# Altium schematic sheet SiLPA.schdoc: SiLPA
size 420 x 297 mm; EDA_Number: ARTIQ; Projet: ARTIQ/SINARA; Author: G.Kasprowicz; CompanyName: WUT ISE; DrawnBy: G.Kasprowicz; Organization: WUT ISE; Address1: PW ISE; Address2: Nowowiejska 15/19 00-665 Warsaw; Address3: gkasprow@gmail.com; DocumentNumber: 1; Revision: 2; SheetNumber: 1; SheetTotal: 7; ModifiedBy: -; CheckedDate: -; Title2: Top; DivGrp: WUT ISE; Designer: G.Kasprowicz; ModifiedDate: -; ProjectName: Sensor Box
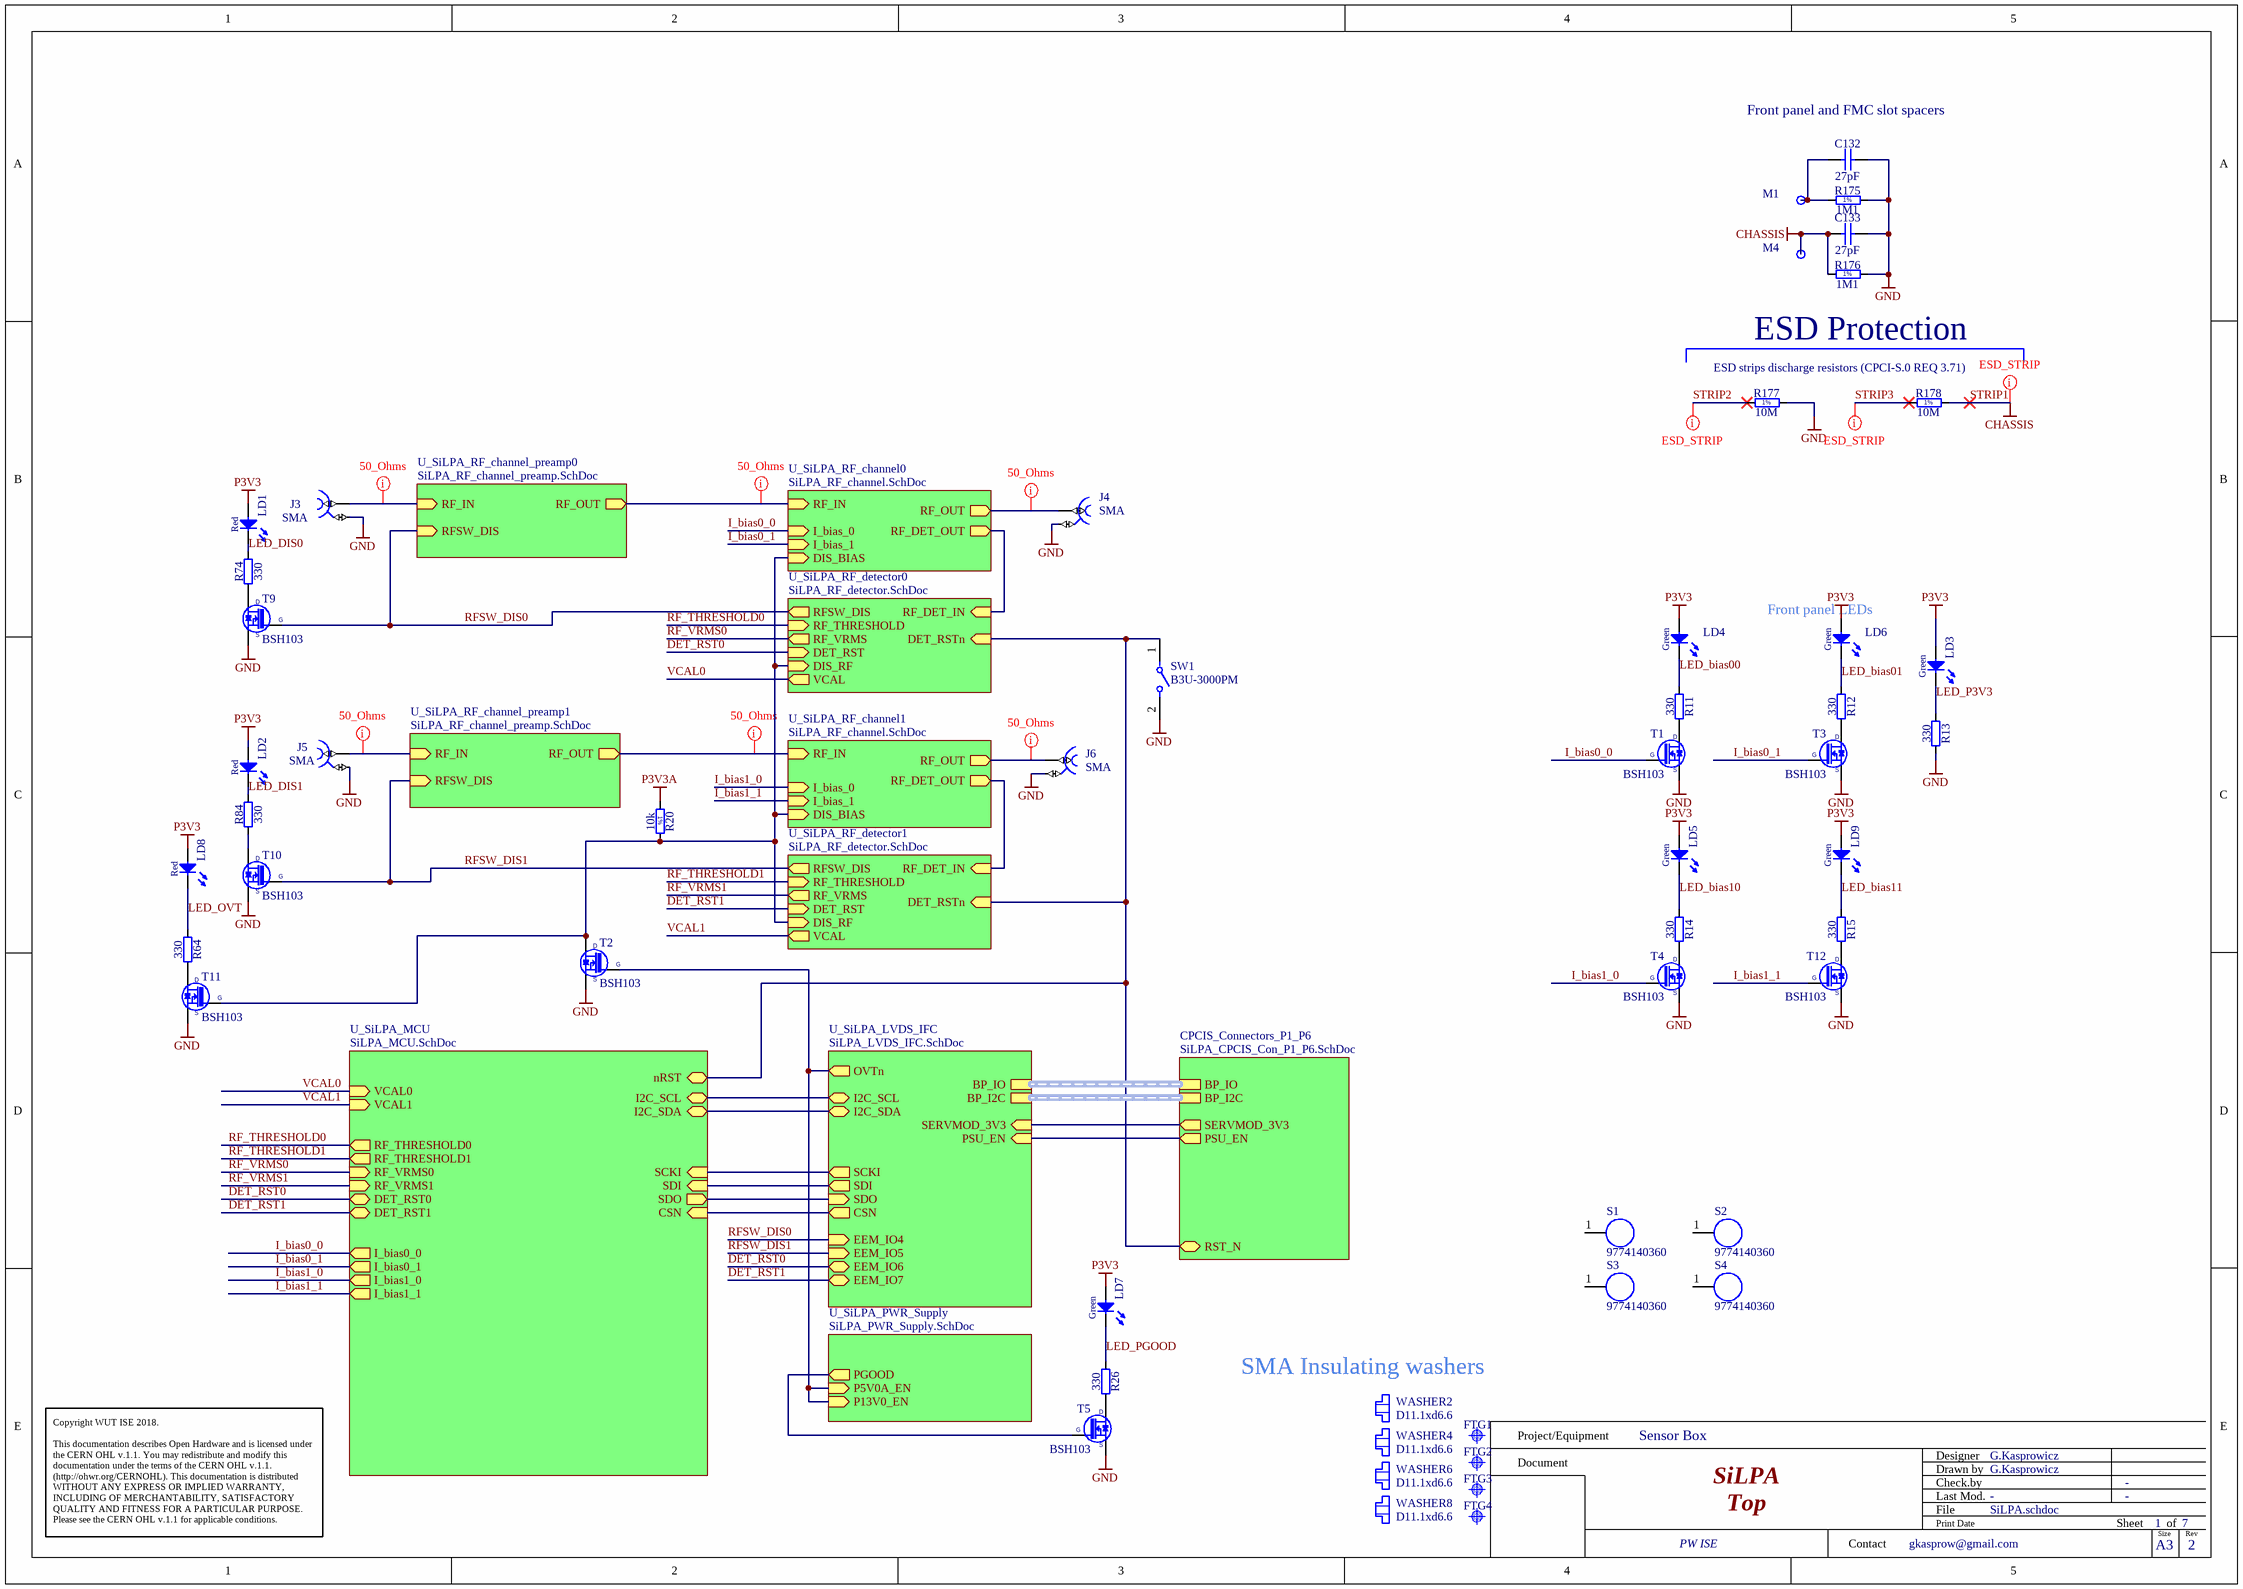
[diagram p0: SiLPA.schdoc]

## Parts
C132  27pF  [CAPC1005X55N]
C133  27pF  [CAPC1005X55N]
FTG1  Use only in PCB  [FIDUCIAL_TOP_C100-200]  (value not drawn)
FTG2  Use only in PCB  [FIDUCIAL_TOP_S100-200]  (value not drawn)
FTG3  Use only in PCB  [FIDUCIAL_TOP_S100-200]  (value not drawn)
FTG4  Use only in PCB  [FIDUCIAL_TOP_S100-200]  (value not drawn)
J3  SMA  [DELOCK_65848]
J4  SMA  [DELOCK_65848]
J5  SMA  [DELOCK_65848]
J6  SMA  [DELOCK_65848]
LD1  Red  [LED_AVAGO_HSMC-C120]
LD2  Red  [LED_AVAGO_HSMC-C120]
LD3  Green  [LED_AVAGO_HSME-C120]
LD4  Green  [LED_AVAGO_HSME-C120]
LD5  Green  [LED_AVAGO_HSME-C120]
LD6  Green  [LED_AVAGO_HSME-C120]
LD7  Green  [LED_AVAGO_HSME-C120]
LD8  Red  [LED_AVAGO_HSMC-C120]
LD9  Green  [LED_AVAGO_HSME-C120]
M1  Plated Hole  [MTG300_600]  (value not drawn)  (no BOM)
M4  Plated Hole  [MTG300_600]  (value not drawn)  (no BOM)
R11  330  [RESC1005X40N]
R12  330  [RESC1005X40N]
R13  330  [RESC1005X40N]
R14  330  [RESC1005X40N]
R15  330  [RESC1005X40N]
R20  10k  [RESC1005X40N]
R26  330  [RESC1005X40N]
R64  330  [RESC1005X40N]
R74  330  [RESC1005X40N]
R84  330  [RESC1005X40N]
R175  1M1  [RESC2012X60N]
R176  1M1  [RESC2012X60N]
R177  10M  [RESC2113X55N]
R178  10M  [RESC2113X55N]
S1  9774140360  [9774140360]
S2  9774140360  [9774140360]
S3  9774140360  [9774140360]
S4  9774140360  [9774140360]
SW1  B3U-3000PM  [FP-B3U-3000PM-MFG]
T1  BSH103  [SOT95P230X110-3N]
T2  BSH103  [SOT95P230X110-3N]
T3  BSH103  [SOT95P230X110-3N]
T4  BSH103  [SOT95P230X110-3N]
T5  BSH103  [SOT95P230X110-3N]
T9  BSH103  [SOT95P230X110-3N]
T10  BSH103  [SOT95P230X110-3N]
T11  BSH103  [SOT95P230X110-3N]
T12  BSH103  [SOT95P230X110-3N]
WASHER2  D11.1xd6.6  [Keystone_7687]
WASHER4  D11.1xd6.6  [Keystone_7687]
WASHER6  D11.1xd6.6  [Keystone_7687]
WASHER8  D11.1xd6.6  [Keystone_7687]

## Sub-sheets
CPCIS_Connectors_P1_P6 = SiLPA_CPCIS_Con_P1_P6.SchDoc: BP_I2C (harness I2C), SERVMOD_3V3 (out), RST_N (bidir), BP_IO (harness EEM_LVDS), PSU_EN (out)
U_SiLPA_LVDS_IFC = SiLPA_LVDS_IFC.SchDoc: I2C_SCL (bidir), EEM_IO6 (bidir), SCKI (out), SDI (out), SDO (in), EEM_IO5 (in), I2C_SDA (bidir), CSN (out), EEM_IO4 (in), EEM_IO7 (bidir), OVTn (out), BP_IO (harness EEM_LVDS), BP_I2C (harness I2C), SERVMOD_3V3 (in), PSU_EN (in)
U_SiLPA_MCU = SiLPA_MCU.SchDoc: RF_THRESHOLD0 (out), RF_THRESHOLD1 (out), RF_VRMS0 (in), RF_VRMS1 (in), DET_RST0 (bidir), DET_RST1 (bidir), CSN (in), SDO (out), SDI (in), SCKI (in), I2C_SCL (bidir), I2C_SDA (bidir), VCAL1 (in), VCAL0 (in), I_bias0_0 (out), I_bias0_1 (out), I_bias1_0 (out), I_bias1_1 (out), nRST (bidir)
U_SiLPA_PWR_Supply = SiLPA_PWR_Supply.SchDoc: PGOOD (out), P5V0A_EN (in), P13V0_EN (in)
U_SiLPA_RF_channel0 = SiLPA_RF_channel.SchDoc: RF_OUT (out), RF_IN (in), RF_DET_OUT (out), I_bias_1 (in), I_bias_0 (in), DIS_BIAS (in)
U_SiLPA_RF_channel1 = SiLPA_RF_channel.SchDoc: RF_OUT (out), RF_IN (in), RF_DET_OUT (out), I_bias_1 (in), I_bias_0 (in), DIS_BIAS (in)
U_SiLPA_RF_channel_preamp0 = SiLPA_RF_channel_preamp.SchDoc: RF_IN (in), RF_OUT (out), RFSW_DIS (in)
U_SiLPA_RF_channel_preamp1 = SiLPA_RF_channel_preamp.SchDoc: RF_IN (in), RF_OUT (out), RFSW_DIS (in)
U_SiLPA_RF_detector0 = SiLPA_RF_detector.SchDoc: RF_DET_IN (in), RFSW_DIS (out), RF_THRESHOLD (in), RF_VRMS (out), DET_RST (in), VCAL (out), DIS_RF (in), DET_RSTn (in)
U_SiLPA_RF_detector1 = SiLPA_RF_detector.SchDoc: RF_DET_IN (in), RFSW_DIS (out), RF_THRESHOLD (in), RF_VRMS (out), DET_RST (in), VCAL (out), DET_RSTn (in), DIS_RF (in)

## Nets
GND: C132.2 C133.2 J3.2 J4.2 J5.2 J6.2 R13.2 R175.2 R176.2 R177.2 SW1.2 T1.2(S) T2.2(S) T3.2(S) T4.2(S) T5.2(S) T9.2(S) T10.2(S) T11.2(S) T12.2(S)
P3V3: LD1.2(A) LD2.2(A) LD3.2(A) LD4.2(A) LD5.2(A) LD6.2(A) LD7.2(A) LD8.2(A) LD9.2(A)
P3V3A: R20.1
STRIP1: C133.1 M4.1 R176.1 R178.2  [also labelled CHASSIS]
DET_RST0: sheet U_SiLPA_LVDS_IFC/EEM_IO6, sheet U_SiLPA_RF_detector0/DET_RST, sheet U_SiLPA_MCU/DET_RST0
DET_RST1: sheet U_SiLPA_LVDS_IFC/EEM_IO7, sheet U_SiLPA_RF_detector1/DET_RST, sheet U_SiLPA_MCU/DET_RST1
I_bias0_0: T1.1(G) ; sheet U_SiLPA_RF_channel0/I_bias_0, sheet U_SiLPA_MCU/I_bias0_0
I_bias0_1: T3.1(G) ; sheet U_SiLPA_RF_channel0/I_bias_1, sheet U_SiLPA_MCU/I_bias0_1
I_bias1_0: T4.1(G) ; sheet U_SiLPA_RF_channel1/I_bias_0, sheet U_SiLPA_MCU/I_bias1_0
I_bias1_1: T12.1(G) ; sheet U_SiLPA_RF_channel1/I_bias_1, sheet U_SiLPA_MCU/I_bias1_1
LED_bias00: LD4.1(C) R11.1
LED_bias01: LD6.1(C) R12.1
LED_bias10: LD5.1(C) R14.1
LED_bias11: LD9.1(C) R15.1
LED_DIS0: LD1.1(C) R74.1
LED_DIS1: LD2.1(C) R84.1
LED_OVT: LD8.1(C) R64.1
LED_P3V3: LD3.1(C) R13.1
LED_PGOOD: LD7.1(C) R26.1
RF_THRESHOLD0: sheet U_SiLPA_RF_detector0/RF_THRESHOLD, sheet U_SiLPA_MCU/RF_THRESHOLD0
RF_THRESHOLD1: sheet U_SiLPA_RF_detector1/RF_THRESHOLD, sheet U_SiLPA_MCU/RF_THRESHOLD1
RF_VRMS0: sheet U_SiLPA_RF_detector0/RF_VRMS, sheet U_SiLPA_MCU/RF_VRMS0
RF_VRMS1: sheet U_SiLPA_RF_detector1/RF_VRMS, sheet U_SiLPA_MCU/RF_VRMS1
RFSW_DIS0: T9.1(G) ; sheet U_SiLPA_LVDS_IFC/EEM_IO4, sheet U_SiLPA_RF_channel_preamp0/RFSW_DIS, sheet U_SiLPA_RF_detector0/RFSW_DIS
RFSW_DIS1: T10.1(G) ; sheet U_SiLPA_LVDS_IFC/EEM_IO5, sheet U_SiLPA_RF_channel_preamp1/RFSW_DIS, sheet U_SiLPA_RF_detector1/RFSW_DIS
STRIP2: R177.1
STRIP3: R178.1
VCAL0: sheet U_SiLPA_RF_detector0/VCAL, sheet U_SiLPA_MCU/VCAL0
VCAL1: sheet U_SiLPA_RF_detector1/VCAL, sheet U_SiLPA_MCU/VCAL1
NetC132_1: C132.1 M1.1 R175.1
NetJ3_1: J3.1 ; sheet U_SiLPA_RF_channel_preamp0/RF_IN
NetJ4_1: J4.1 ; sheet U_SiLPA_RF_channel0/RF_OUT
NetJ5_1: J5.1 ; sheet U_SiLPA_RF_channel_preamp1/RF_IN
NetJ6_1: J6.1 ; sheet U_SiLPA_RF_channel1/RF_OUT
NetR11_2: R11.2 T1.3(D)
NetR12_2: R12.2 T3.3(D)
NetR14_2: R14.2 T4.3(D)
NetR15_2: R15.2 T12.3(D)
NetR20_2: R20.2 T2.3(D) T11.1(G) ; sheet U_SiLPA_RF_channel0/DIS_BIAS, sheet U_SiLPA_RF_detector0/DIS_RF, sheet U_SiLPA_RF_detector1/DIS_RF, sheet U_SiLPA_RF_channel1/DIS_BIAS
NetR26_2: R26.2 T5.3(D)
NetR64_2: R64.2 T11.3(D)
NetR74_2: R74.2 T9.3(D)
NetR84_2: R84.2 T10.3(D)
NetSW1_1: SW1.1 ; sheet U_SiLPA_RF_detector0/DET_RSTn, sheet U_SiLPA_RF_detector1/DET_RSTn, sheet U_SiLPA_MCU/nRST, sheet CPCIS_Connectors_P1_P6/RST_N
NetT2_1: T2.1(G) ; sheet U_SiLPA_LVDS_IFC/OVTn, sheet U_SiLPA_PWR_Supply/P5V0A_EN, sheet U_SiLPA_PWR_Supply/P13V0_EN
NetT5_1: T5.1(G) ; sheet U_SiLPA_PWR_Supply/PGOOD
(unnamed): sheet U_SiLPA_LVDS_IFC/I2C_SCL, sheet U_SiLPA_MCU/I2C_SCL
(unnamed): sheet U_SiLPA_LVDS_IFC/SCKI, sheet U_SiLPA_MCU/SCKI
(unnamed): sheet U_SiLPA_LVDS_IFC/SDI, sheet U_SiLPA_MCU/SDI
(unnamed): sheet U_SiLPA_LVDS_IFC/SDO, sheet U_SiLPA_MCU/SDO
(unnamed): sheet U_SiLPA_LVDS_IFC/I2C_SDA, sheet U_SiLPA_MCU/I2C_SDA
(unnamed): sheet U_SiLPA_LVDS_IFC/CSN, sheet U_SiLPA_MCU/CSN
(unnamed): sheet U_SiLPA_LVDS_IFC/SERVMOD_3V3, sheet CPCIS_Connectors_P1_P6/SERVMOD_3V3
(unnamed): sheet U_SiLPA_LVDS_IFC/PSU_EN, sheet CPCIS_Connectors_P1_P6/PSU_EN
(unnamed): sheet U_SiLPA_RF_channel0/RF_IN, sheet U_SiLPA_RF_channel_preamp0/RF_OUT
(unnamed): sheet U_SiLPA_RF_channel0/RF_DET_OUT, sheet U_SiLPA_RF_detector0/RF_DET_IN
(unnamed): sheet U_SiLPA_RF_channel_preamp1/RF_OUT, sheet U_SiLPA_RF_channel1/RF_IN
(unnamed): sheet U_SiLPA_RF_detector1/RF_DET_IN, sheet U_SiLPA_RF_channel1/RF_DET_OUT

Not connected (* = marked no-connect by the designer): S1 1; S2 1; S3 1; S4 1

## Buses and harness runs
harness sheet CPCIS_Connectors_P1_P6/BP_I2C = sheet U_SiLPA_LVDS_IFC/BP_I2C
harness sheet CPCIS_Connectors_P1_P6/BP_IO = sheet U_SiLPA_LVDS_IFC/BP_IO

## Layout directives
net class 50_Ohms: (no net found under the mark), NetJ3_1, NetJ4_1, NetJ5_1, NetJ6_1
net class ESD_STRIP: STRIP1, STRIP2, STRIP3

## Notes on the sheet
- (near C132) Front panel and FMC slot spacers
- ESD strips discharge resistors (CPCI-S.0 REQ 3.71)
- ESD Protection
- (near LD6) Front panel LEDs
- (near WASHER2) SMA Insulating washers
- Project/Equipment
- Document
- Designer
- Drawn by
- Check.by
- Copyright WUT ISE 2018.
  This documentation describes Open Hardware and is licensed under the CERN OHL v.1.1. You may redistribute and modify this documentation under the terms of the CERN OHL v.1.1. (http://ohwr.org/CERNOHL). This documentation is distributed WITHOUT ANY EXPRESS OR IMPLIED WARRANTY, INCLUDING OF MERCHANTABILITY, SATISFACTORY QUALITY AND FITNESS FOR A PARTICULAR PURPOSE. Please see the CERN OHL v.1.1 for applicable conditions.
- Contact
- File
- Last Mod.
- Print Date
- Sheet
- Size
- A3
- of
- Rev
- (in symbol R0402_10K_1%_0.0625W_100PPM) 1%
- (in symbol R0805_1M1_1%_0.125W_100PPM) 1%
- (in symbol R0805_10M_1%_0.125W_100PPM_VISHAY_CRCW e3) 1%

## Library data of the parts
C132 C133 = CC0402_27PF_50V_5%_C0G: Non-polarised capacitor; Part Description: SMD Multilayer Chip Ceramic Capacitor; Manufacturer: GENERIC; Manufacturer1 Part Number: C0402C270J5GACTU; Voltage: 50V; TC: C0G/NP0; Tolerance: ±5%; Part Number: CC0402_27PF_50V_5%_C0G; Component Kind: Standard; Component Type: Standard; Pin Count: 2; Value: 27pF; Status: Preferred; Manufacturer Part Number: CC0402_27PF_50V_5%_C0G; Case: 0402; Mounted: Yes; Socket: No; SMD: Yes; Manufacturer1 Example: KEMET; Manufacturer1 ComponentHeight: 0.55mm; HelpURL: \\cern.ch\dfs\Applications\Altium\Datasheets\CC0402_C0G_KEMET_(Commercial Grade).pdf; Author: CERN DEM JLC; CreateDate: 25/10/2012; LatestRevisionDate: 22/04/2015; Sense: No
FTG1 = FIDUCIAL_TARGET_C100-200: Fiducial Target; Part Description: Round Fiducial Target, Top Layer, 1.0mm, Top Solder 2.0mm, Keepout =2.0mm; Mounted: No; Part Number: FIDUCIAL_TARGET_C100-200; Component Kind: Standard (No BOM); Component Type: Standard (No BOM); Pin Count: 1; Family: Fiducial; Socket: No; SMD: Yes; Sense: No; Status: None; ComponentHeight: 0mm; HelpURL: Undefined; Author: CERN DEM JLC; CreateDate: 09.02.2010; LatestRevisionDate: 04.04.2012; PackageDescription: Round Fiducial Target, Top Layer, 1.0mm, Top Solder 2.0mm, Keepout =2.0mm
FTG2-FTG4 = FIDUCIAL_TARGET_S100-200: Fiducial Target; Part Description: Square Fiducial Target, Top Layer, 1.0mm, Top Solder 2.0mm, Keepout =2.0mm; Mounted: No; Part Number: FIDUCIAL_TARGET_S100-200; Component Kind: Standard (No BOM); Component Type: Standard (No BOM); Pin Count: 1; Family: Fiducial; Socket: No; SMD: Yes; Sense: No; Status: None; ComponentHeight: 0mm; HelpURL: Undefined; Author: CERN DEM JLC; CreateDate: 09.02.2010; LatestRevisionDate: 04.04.2012; PackageDescription: Square Fiducial Target, Top Layer, 1.0mm, Top Solder 2.0mm, Keepout =2.0mm
J3-J6 = DELOCK_65848: 50 Ohm Through Hole SMA Right Angle PCB Jack; Manufacturer: DELOCK; Manufacturer Part Number: 5848 (4043619658480); PressFit: No; Part Number: DELOCK_65848; Component Kind: Standard; Component Type: Standard; Pin Count: 5; Family: SMA; Mounted: Yes; Socket: No; SMD: No; Sense: No; Status: None; Part Description: 50 Ohm Through Hole SMA Right Angle PCB Jack; ComponentHeight: 12.5; HelpURL: \\cern.ch\dfs\Applications\Altium\Datasheets\AMPHENOL_132203-16.pdf; Author: GK; CreateDate: 13.05.2019; LatestRevisionDate: 13.05.2019
LD1 LD2 LD8 = LED_AVAGO_HSMC-C120: LED Red 1C 2A; Part Description: High Performance Right Angle Chip Red LED; Manufacturer: AVAGO TECHNOLOGIES; PressFit: No; Bonding: No; Part Number: LED_AVAGO_HSMC-C120; Component Kind: Standard; Component Type: Standard; Color: Red; PackageDescription: Red Chip LED, 2-Leads, Body 1.7x1.1mm, Side Emitting Package; Manufacturer Part Number: HSMC-C120; Pin Count: 2; Mounted: Yes; Socket: No; SMD: Yes; Sense: No; ComponentHeight: 0.7mm; HelpURL: \\cern.ch\dfs\Applications\Altium\Datasheets\LED_AVAGO_HSMC-C120.pdf; ComponentLink1URL: \\cern.ch\dfs\Applications\Altium\Datasheets\LED_AVAGO_HSMC-C120_DESIGN-GUIDE.pdf; ComponentLink1Description: Design Guide; Author: CERN DEM JMW; CreateDate: 22.07.2009; LatestRevisionDate: 20.06.2012
LD3-LD7 LD9 = LED_AVAGO_HSME-C120: LED Green 1C 2A; Part Description: High Performance Right Angle Chip Green LED; Manufacturer: AVAGO TECHNOLOGIES; PressFit: No; Bonding: No; Part Number: LED_AVAGO_HSME-C120; Component Kind: Standard; Component Type: Standard; Color: Green; PackageDescription: Green Chip LED, 2-Leads, Body 1.7x1.1mm, Side Emitting Package; Manufacturer Part Number: HSME-C120; Pin Count: 2; Mounted: Yes; Socket: No; SMD: Yes; Sense: No; ComponentHeight: 0.7mm; HelpURL: \\cern.ch\dfs\Applications\Altium\Datasheets\LED_AVAGO_HSME-C120.pdf; ComponentLink1URL: \\cern.ch\dfs\Applications\Altium\Datasheets\LED_AVAGO_HSME-C110_DESIGN-GUIDE.pdf; ComponentLink1Description: Design Guide; Author: CERN DEM JMW; CreateDate: 22.07.2009; LatestRevisionDate: 20.06.2012
M1 M4 = PLATED_HOLE3.0_PAD6.0: Single Terminal Socket; Part Description: Plated Through Hole: Hole Dia.=3.0mm Pad Dia.=6.0mm; Mounted: No; Table: Pads; Part Number: PLATED_HOLE3.0_PAD6.0; Component Type: Standard (No BOM); Designator: Single Terminal Socket; Library Reference: Single Terminal Socket; Pin Count: 1; Family: Plated Hole; Socket: No; SMD: No; Status: None; ComponentHeight: 0mm; Author: CERN DEM JLC; CreateDate: 26.05.2008; LatestRevisionDate: 26.05.2008; PackageDescription: Plated Through Hole: Hole Dia.=3.0mm Pad Dia.=6.0mm
R11-R15 R26 R64 R74 R84 = R0402_330R_1%_0.0625W_100PPM: Resistor - 1%; Part Description: General Purpose Thick Film Chip Resistor; Manufacturer: GENERIC; Manufacturer1 Part Number: 232270673301L; TC: ±100ppm/°C; PressFit: No; Part Number: R0402_330R_1%_0.0625W_100PPM; Component Kind: Standard; Component Type: Standard; Pin Count: 2; Value: 330; Status: Not Recommended; Power: 0.0625W; Tolerance: ±1%; Manufacturer Part Number: R0402_330R_1%_0.0625W_100PPM; Case: 0402; Mounted: Yes; Sense: No; Socket: No; SMD: Yes; Manufacturer1 Example: YAGEO PHYCOMP; Manufacturer1 ComponentHeight: 0.4mm; HelpURL: \\cern.ch\dfs\Applications\Altium\Datasheets\R0402_Phycomp_RC0402.pdf; Author: CERN DEM JLC; CreateDate: 03.12.2007; LatestRevisionDate: 17.10.2012
R20 = R0402_10K_1%_0.0625W_100PPM: Resistor - 1%; Part Description: General Purpose Thick Film Chip Resistor; Manufacturer: GENERIC; Manufacturer1 Part Number: 232270671003L; TC: ±100ppm/°C; Table: Resistors SMD; Part Number: R0402_10K_1%_0.0625W_100PPM; Component Kind: Standard; Component Type: Standard; Pin Count: 2; Value: 10k; Status: Not recommended; Power: 0.0625W; Tolerance: ±1%; Manufacturer Part Number: R0402_10K_1%_0.0625W_100PPM; Case: 0402; Mounted: Yes; Socket: No; SMD: Yes; Manufacturer1 Example: YAGEO PHYCOMP; Manufacturer1 ComponentHeight: 0.4mm; HelpURL: \\cern.ch\dfs\Applications\Altium\Datasheets\R0402_Phycomp_RC0402.pdf; Author: CERN DEM JLC; CreateDate: 2007-12-03; LatestRevisionDate: 2012-10-17
R175 R176 = R0805_1M1_1%_0.125W_100PPM: Resistor - 1%; Part Description: General Purpose Thick Film Chip Resistor; Manufacturer: GENERIC; Manufacturer1 Part Number: NRC10F1104TRF; Power: 0.125W; TC: ±100ppm/°C; PressFit: No; Part Number: R0805_1M1_1%_0.125W_100PPM; Component Kind: Standard; Component Type: Standard; Pin Count: 2; Value: 1M1; Status: Preferred; Tolerance: ±1%; Manufacturer Part Number: R0805_1M1_1%_0.125W_100PPM; Case: 0805; Mounted: Yes; Sense: No; Socket: No; SMD: Yes; Manufacturer1 Example: NIC COMPONENT; Manufacturer1 ComponentHeight: 0.6mm; HelpURL: \\cern.ch\dfs\Applications\Altium\Datasheets\R0805_NIC_NRC.pdf; Author: CERN DEM JLC; CreateDate: 03/12/2007; LatestRevisionDate: 13/03/2008
R177 R178 = R0805_10M_1%_0.125W_100PPM_VISHAY_CRCW e3: Resistor - 1%; Part Description: 150V, Standard Thick Film Chip Resistor; Manufacturer: VISHAY DALE; Manufacturer Part Number: CRCW080510M0FKEA; Power: 0.125W; TC: ±100ppm/°C; PressFit: No; Part Number: R0805_10M_1%_0.125W_100PPM_VISHAY_CRCW e3; Component Kind: Standard; Component Type: Standard; Pin Count: 2; Value: 10M; Status: None; Tolerance: ±1%; Case: 0805; Mounted: Yes; Sense: No; Socket: No; SMD: Yes; ComponentHeight: 0.5mm; HelpURL: \\cern.ch\dfs\Applications\Altium\Datasheets\R0805_VISHAY_CRCW e3.pdf; Author: CERN DEM BC; CreateDate: 2019-11-12; LatestRevisionDate: 2019-11-12
S1-S4 = WA-SMSI,  9774140360: WA-SMSI SMD Steel Spacer with internal Thread; Manufacturer: Wurth Elektronik; partNo: 9774140360; ComponentLink1Description: Manufacturer; ComponentLink1URL: http://www.we-online.de; Created by: Baojun Chen; Created Date: 20.Oct.2015; ComponentLink2Description: Datasheet; ComponentLink2URL: http://katalog.we-online.de/em/datasheet/9774140360.pdf
SW1 = CMP-08834-000057-1: SWITCH TACTILE SPST-NO 0.05A 12V; Connector Type: SMD/SMT; Switch Travel: 0.2mm; Throw Configuration: SPST; Illumination Type: Non-Illuminated; Mechanical Life: 100000Cycles; Actuator Length: 0.7mm; Switch Function: Off-Mom; Ratings: Dust Proof; Operating Force: 1.59N; Max Current Rating: 50mA; Contact Resistance: 100mR; Termination: Gull Wing; Packaging: Tape and Reel; Case/Package: SMD/SMT; Orientation: Right Angle; Package Quantity: 1000; Mount: Surface Mount; Series: B3U; Max Voltage Rating (DC): 12V; Depth: 3.2mm; Max Operating Temperature: 70°C; RoHS Compliant: Yes; Weight: 0.022g; Min Operating Temperature: -25°C; Electrical Life: 100000Cycles; Current Rating: 50mA; Length: 4mm; Voltage Rating (DC): 12V
T1-T5 T9-T12 = BSH103: N-CHANNEL MOSFET WITH DIODE; Part Description: 30V, 850mA N-Channel Enhancement Mode Field-Effect Transistor; Manufacturer: NEXPERIA; PressFit: No; Bonding: No; Part Number: BSH103; Component Kind: Standard; Component Type: Standard; Device: BSH103; PackageDescription: SOT23, 0.95mm Pitch; 3 Pin, 1.30mm W X 2.90mm L X 1.10mm H body, IPC Medium Density; Manufacturer Part Number: BSH103; Pin Count: 3; Case: SOT23-3; Mounted: Yes; Socket: No; SMD: Yes; Sense: No; ComponentHeight: 1.1mm; HelpURL: \\cern.ch\dfs\Applications\Altium\Datasheets\BSH103.pdf; Author: CERN DEM JLC; CreateDate: 16.03.2010; LatestRevisionDate: 20.06.2017
WASHER2 WASHER4 WASHER6 WASHER8 = Keystone_7687: SMA_Shoulder Washer; Part Number: custom 3D; Part Description: Polyphenylene Sulfide PPS Shoulder Washer; PressFit: No; Component Kind: Standard; Component Type: Mechanical; Footprint: custom 3D; Pin Count: 0; PackageDescription: Polyphenylene Sulfide PPS Shoulder Washer; Mounted: Yes; Socket: No; SMD: No; Sense: No; Status: None; Value: D11.1xd6.6; Manufacturer: custom 3D; Manufacturer Part Number: custom 3D; ComponentHeight: 1.91mm; HelpURL: \\cern.ch\dfs\Applications\Altium\Datasheets\AAVID-THERMALLOY_7721-7PPSG.pdf; Author: GK; CreateDate: 28.01.2016; LatestRevisionDate: 28.01.2016